# Altium project Rigid-QFN-1.PrjPcb
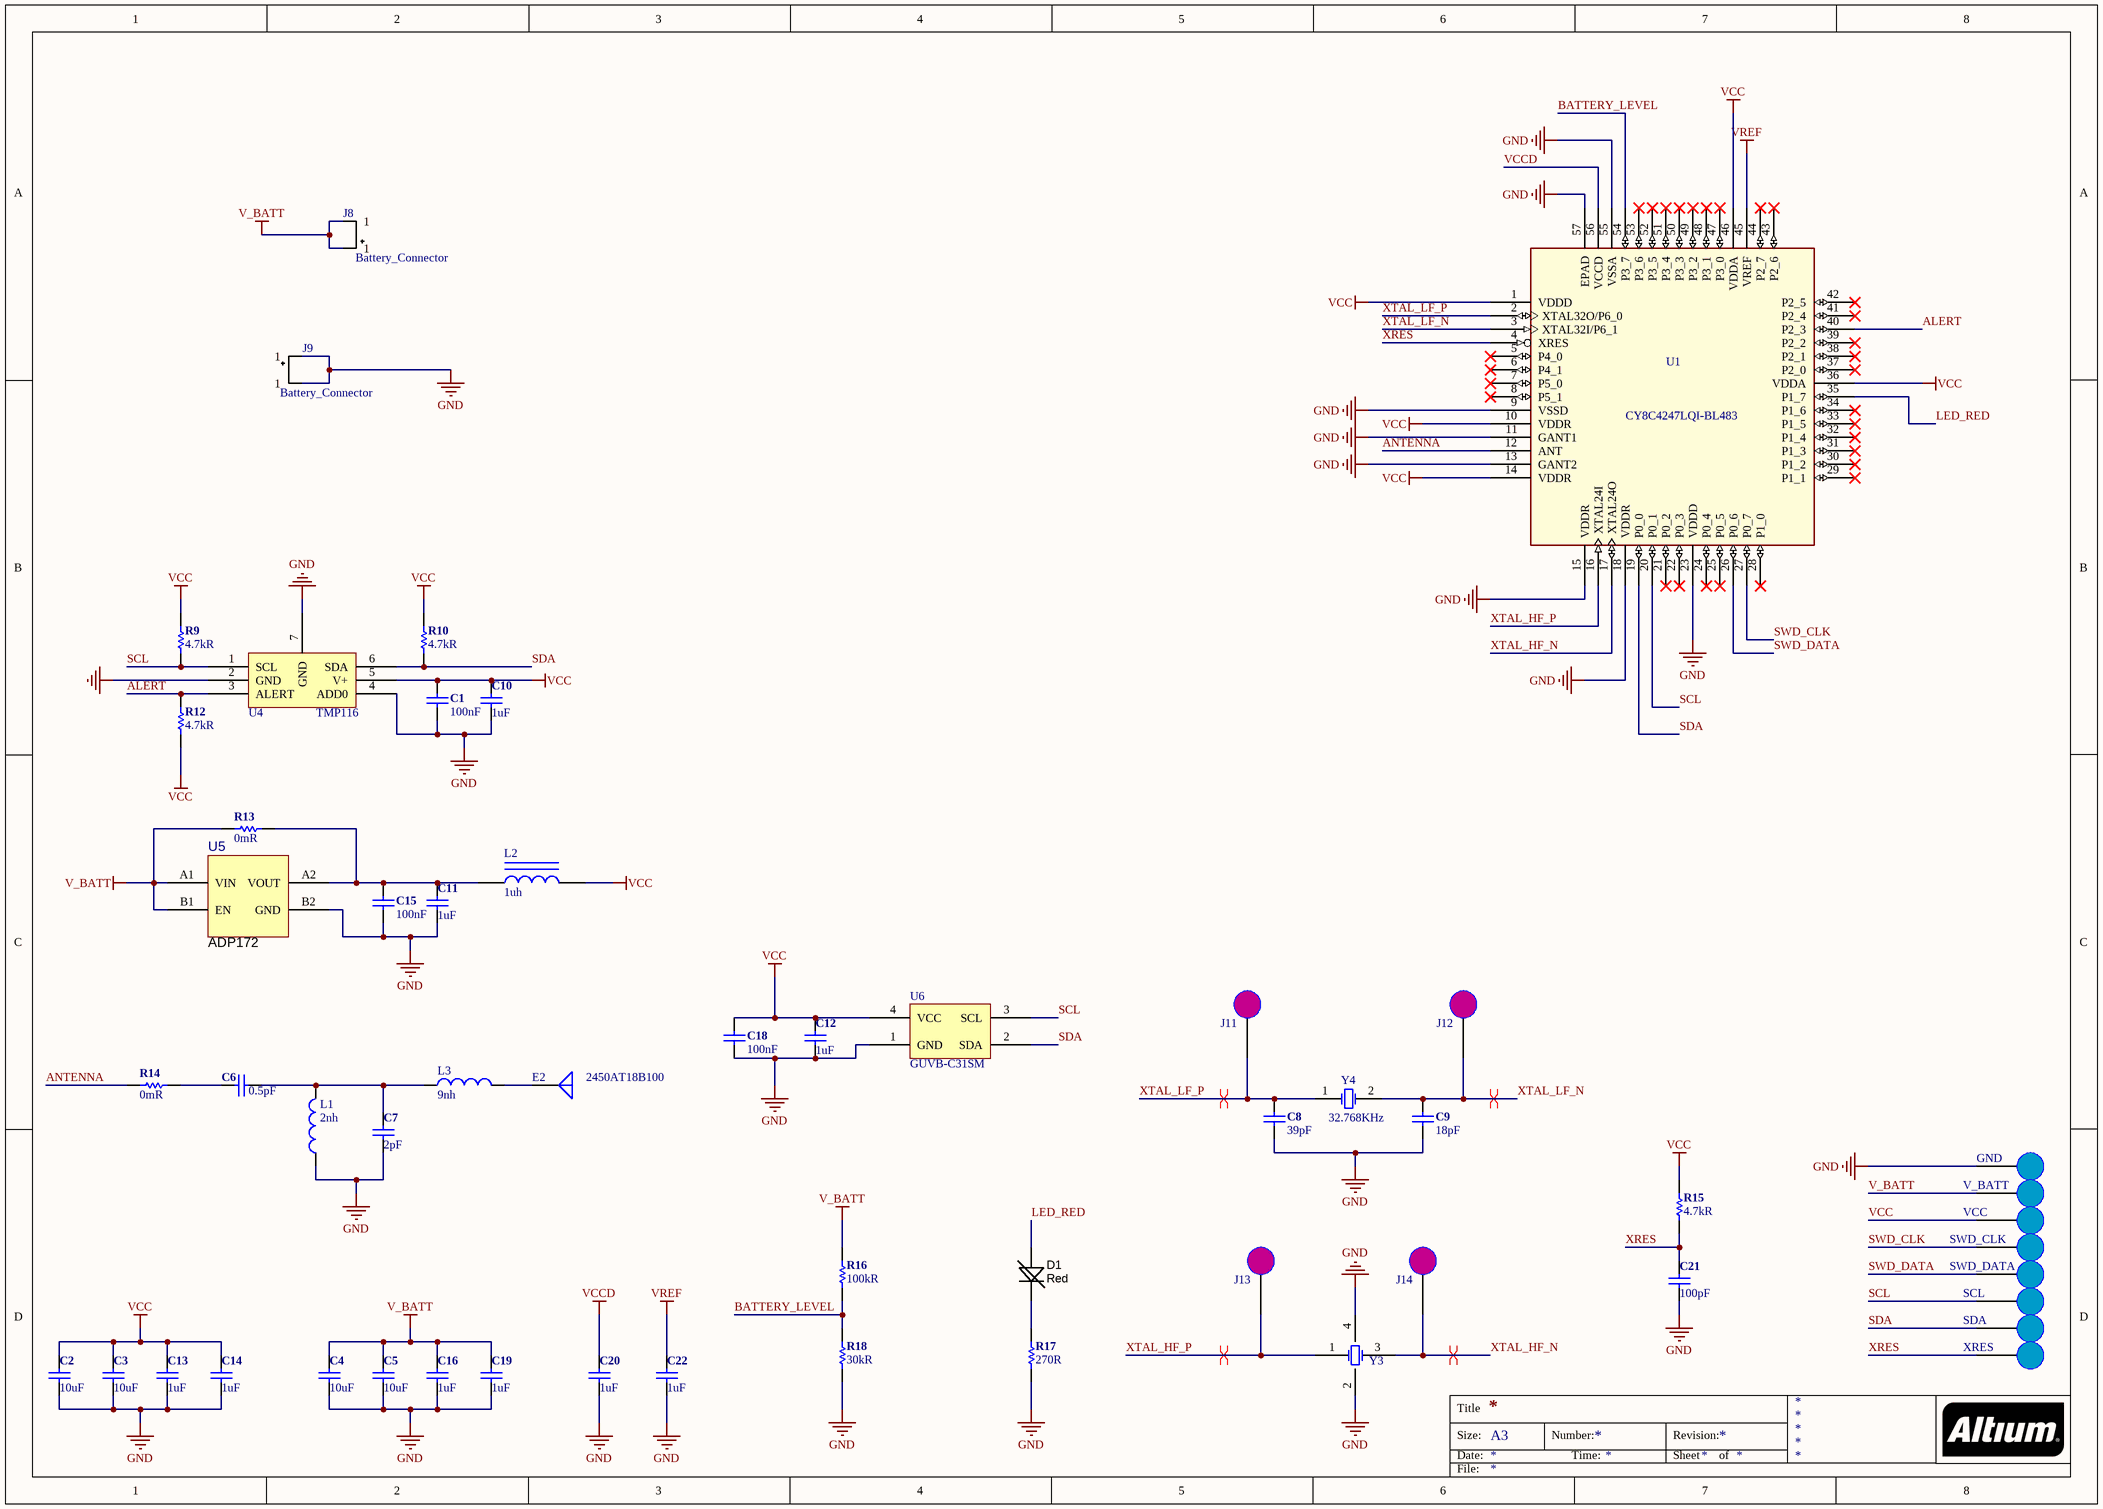
[diagram p0: Rigid-QFN-1.SchDoc]
1 sheet, 55 parts. Net scope: global (net labels, ports and power ports of the same name join across sheets).
Board file: Rigid-QFN-1.PcbDoc

## Sheet Rigid-QFN-1.SchDoc
size A3

### Parts
C1  100nF  [CAP_0402(1005)_M]
C2  10uF  [CAP_0402(1005)_M]
C3  10uF  [CAP_0402(1005)_M]
C4  10uF  [CAP_0402(1005)_M]
C5  10uF  [CAP_0402(1005)_M]
C6  0.5pF  [CAP_0402(1005)_M]
C7  2pF  [CAP_0402(1005)_M]
C8  39pF  [CAP_0402(1005)_M]
C9  18pF  [CAP_0402(1005)_M]
C10  1uF  [CAP_0402(1005)_M]
C11  1uF  [CAP_0402(1005)_M]
C12  1uF  [CAP_0402(1005)_M]
C13  1uF  [CAP_0402(1005)_M]
C14  1uF  [CAP_0402(1005)_M]
C15  100nF  [CAP_0402(1005)_M]
C16  1uF  [CAP_0402(1005)_M]
C18  100nF  [CAP_0402(1005)_M]
C19  1uF  [CAP_0402(1005)_M]
C20  1uF  [CAP_0402(1005)_M]
C21  100pF  [CAP_0402(1005)_M]
C22  1uF  [CAP_0402(1005)_M]
D1  Red  [LED_0402(1005)]
E2  2450AT18B100  [2450AT18B100]
GND  Probe-Pin Pad  [Pogo-Pin-Pad]  (value not drawn)
J8  Battery_Connector  [Battery_PAD]
J9  Battery_Connector  [Battery_PAD]
J11  Probe-CLOCK  [Pogo-CLOCK-PAD]  (value not drawn)
J12  Probe-CLOCK  [Pogo-CLOCK-PAD]  (value not drawn)
J13  Probe-CLOCK  [Pogo-CLOCK-PAD]  (value not drawn)
J14  Probe-CLOCK  [Pogo-CLOCK-PAD]  (value not drawn)
L1  2nh  [IND_0402(1005)_M]
L2  1uh  [IND_0402(1005)_M]
L3  9nh  [IND_0402(1005)_M]
R9  4.7kR  [RES_0402(1005)_M]
R10  4.7kR  [RES_0402(1005)_M]
R12  4.7kR  [RES_0402(1005)_M]
R13  0mR  [RES_0402(1005)_M]
R14  0mR  [RES_0402(1005)_M]
R15  4.7kR  [RES_0402(1005)_M]
R16  100kR  [RES_0402(1005)_M]
R17  270R  [RES_0402(1005)_M]
R18  30kR  [RES_0402(1005)_M]
SCL  Probe-Pin Pad  [Pogo-Pin-Pad]  (value not drawn)
SDA  Probe-Pin Pad  [Pogo-Pin-Pad]  (value not drawn)
SWD_CLK  Probe-Pin Pad  [Pogo-Pin-Pad]  (value not drawn)
SWD_DATA  Probe-Pin Pad  [Pogo-Pin-Pad]  (value not drawn)
U1  CY8C4247LQI-BL483  [QFN40P700X700X60-57N]
U4  TMP116  [WSON-6]
U5  ADP172  [ADP172]
U6  GUVB-C31SM  [GUVB-C31SM]
V_BATT  Probe-Pin Pad  [Pogo-Pin-Pad]  (value not drawn)
VCC  Probe-Pin Pad  [Pogo-Pin-Pad]  (value not drawn)
XRES  Probe-Pin Pad  [Pogo-Pin-Pad]  (value not drawn)
Y3  ECX-2236  [ECX-2236]  (value not drawn)
Y4  32.768KHz  [ABS05]

### Nets
GND: C1.2 C2.2 C3.2 C4.2 C5.2 C7.2 C8.2 C9.2 C10.2 C11.2 C12.2 C13.2 C14.2 C15.2 C16.2 C18.2 C19.2 C20.2 C21.2 C22.2 GND.1 J9.1 L1.1 R17.2 R18.2 U1.9(VSSD) U1.11(GANT1) U1.13(GANT2) U1.15(VDDR) U1.18(VDDR) U1.23(VDDD) U1.55(VSSA) U1.57(EPAD) U4.2(GND) U4.4(ADD0) U4.7(GND) U5.B2(GND) U6.1(GND) Y3.2(GND) Y3.4(GND)
V_BATT: C4.1 C5.1 C16.1 C19.1 J8.1 R13.1 R16.1 U5.A1(VIN) U5.B1(EN) V_BATT.1
VCC: C1.1 C2.1 C3.1 C10.1 C12.1 C13.1 C14.1 C18.1 L2.2 R9.2 R10.2 R12.1 R15.1 U1.1(VDDD) U1.10(VDDR) U1.14(VDDR) U1.36(VDDA) U1.46(VDDA) U4.5(V+) U6.4(VCC) VCC.1
VCCD: C20.1 U1.56(VCCD)
VREF: C22.1 U1.45(VREF)
ALERT: R12.2 U1.40(P2_3) U4.3(ALERT)
ANTENNA: R14.1 U1.12(ANT)
BATTERY_LEVEL: R16.2 R18.1 U1.54(P3_7)
LED_RED: D1.A U1.35(P1_7)
SCL: R9.1 SCL.1 U1.20(P0_1) U4.1(SCL) U6.3(SCL)
SDA: R10.1 SDA.1 U1.19(P0_0) U4.6(SDA) U6.2(SDA)
SWD_CLK: SWD_CLK.1 U1.27(P0_7)
SWD_DATA: SWD_DATA.1 U1.26(P0_6)
XRES: C21.1 R15.2 U1.4(XRES) XRES.1
XTAL_HF_N: J14.1 U1.17(XTAL24O) Y3.3(OSC2)
XTAL_HF_P: J13.1 U1.16(XTAL24I) Y3.1(OSC1)
XTAL_LF_N: C9.1 J12.1 U1.3(XTAL32I/P6_1) Y4.2(OSC2)
XTAL_LF_P: C8.1 J11.1 U1.2(XTAL32O/P6_0) Y4.1(OSC1)
NetC6_1: C6.1 R14.2
NetC6_2: C6.2 C7.1 L1.2 L3.1
NetC11_1: C11.1 C15.1 L2.1 R13.2 U5.A2(VOUT)
NetD1_K: D1.K R17.1
NetE2_1: E2.1(A) L3.2

Not connected (* = marked no-connect by the designer): U1 5(P4_0)* 6(P4_1)* 7(P5_0)* 8(P5_1)* 21(P0_2)* 22(P0_3)* 24(P0_4)* 25(P0_5)* 28(P1_0)* 29(P1_1)* 30(P1_2)* 31(P1_3)* 32(P1_4)* 33(P1_5)* 34(P1_6)* 37(P2_0)* 38(P2_1)* 39(P2_2)* 41(P2_4)* 42(P2_5)* 43(P2_6)* 44(P2_7)* 47(P3_0)* 48(P3_1)* 49(P3_2)* 50(P3_3)* 51(P3_4)* 52(P3_5)* 53(P3_6)*

### Layout directives
differential pair: XTAL_HF_N, XTAL_HF_P, XTAL_LF_N, XTAL_LF_P

### Notes on the sheet
- Title
- Size:
- Date:
- A3
- Number:
- Time:
- Revision:
- Sheet
- of
- File:

### Library data of the parts
C1 C15 C18 = C-0402(1005): ___ OHM ___ mW 0402(1005) SMD; Manufacturer: Yageo; Manufacturer Part Number: CC0402ZRY5V6BB104; Description 1: CAP CER 0.1UF 10V Y5V 0402; Tolerance: 80%; Voltage Rating: 10V; Dielectric: Y5V; Supplier 1: Digi-Key; Supplier Part Number 1: 311-1422-1-ND; Stock 1: 3960; Pricing 1: 1=0.1, 10=0.023, 100=0.0104, 500=0.0075, 1000=0.0059, 2500=0.0053, 5000=0.0049 (USD); Mount: Surface Mount; Case/Package: 0402; Number of Pins: 2; Weight: 2.3E-05oz; Case Code (Metric): 1005; Case Code (Imperial): 0402; Min Operating Temperature: -30°C; Max Operating Temperature: 85°C; Capacitance: 100nF; Packaging: Tape and Reel; Package Quantity: 1; Voltage Rating (DC): 10V; Termination: SMD/SMT; Composition: Ceramic; Length: 1mm; Width: 0.02inch; Thickness: 0.022inch; Depth: 0.5mm; Lead Free: Lead Free; Halogen Free: Halogen Free; ComponentLink1URL: https://datasheet.ciiva.com/176/mlccorderingcode-176345.pdf; ComponentLink1Description: https://datasheet.ciiva.com/176/mlccorderingcode-176345.pdf; ComponentLink2URL: https://datasheet.ciiva.com/176/mlccorderingcode-176346.pdf; ComponentLink2Description: https://datasheet.ciiva.com/176/mlccorderingcode-176346.pdf; ComponentLink3URL: https://datasheet.ciiva.com/176/mlccorderingcode-176347.pdf; ComponentLink3Description: https://datasheet.ciiva.com/176/mlccorderingcode-176347.pdf; ComponentLink4URL: https://datasheet.ciiva.com/13265/upy-gp-np0-16v-to-50v-8-3714-13265323.pdf; ComponentLink4Description: https://datasheet.ciiva.com/13265/upy-gp-np0-16v-to-50v-8-3714-13265323.pdf
C2-C5 = C-0402(1005): ___ OHM ___ mW 0402(1005) SMD; Manufacturer: Murata; Manufacturer Part Number: GRM155R60J106ME15D; Description 1: 10µF 6.3V Ceramic Capacitor X5R 0402 (1005 Metric) 0.039" L x 0.020" W (1.00mm x 0.50mm); Voltage Rating: 6.3V; Tolerance: 20%; Dielectric: X5R; Supplier 1: Digi-Key; Supplier Part Number 1: 490-13238-1-ND; Stock 1: 427251; Pricing 1: 1=0.29, 10=0.196, 100=0.0994, 500=0.068, 1000=0.0602, 2500=0.0576, 5000=0.0523 (USD); Mount: Surface Mount; Case/Package: 0402; Case Code (Metric): 1005; Case Code (Imperial): 0402; Min Operating Temperature: -55°C; Max Operating Temperature: 85°C; Packaging: Tape and Reel; Capacitance: 10uF; Voltage Rating (DC): 6.3V; Length: 0.039inch; Width: 0.02inch; Thickness: 0.026inch; ComponentLink1URL: http://search.murata.co.jp/Ceramy/image/img/A01X/partnumbering_e_01.pdf; ComponentLink1Description: http://search.murata.co.jp/Ceramy/image/img/A01X/partnumbering_e_01.pdf
C6 = C-0402(1005): ___ OHM ___ mW 0402(1005) SMD; Manufacturer: Murata; Manufacturer Part Number: GJM1555C1HR50WB01D; Description 1: Multilayer Ceramic Capacitors MLCC - SMD/SMT 0402 0.5pF 50Volts C0G +/-0.05pF; Voltage Rating: 50V; Dielectric: C0G; Supplier 1: Digi-Key; Supplier Part Number 1: 490-11250-1-ND; Stock 1: 57275; Pricing 1: 1=0.3, 10=0.205, 100=0.1161, 500=0.082, 1000=0.0717, 2500=0.0683, 5000=0.0632 (USD); Mount: Surface Mount; Case/Package: 0402; Case Code (Metric): 1005; Case Code (Imperial): 0402; Min Operating Temperature: -55°C; Max Operating Temperature: 125°C; Package Quantity: 10000; Capacitance: 0.5pF; Packaging: Tape and Reel; Voltage Rating (DC): 50V; Termination: SMD/SMT; Voltage: 50V; Length: 1mm; Height: 0.5mm; Width: 0.02inch; Thickness: 0.022inch; Depth: 0.5mm; Radiation Hardening: No; Lead Free: Lead Free; ComponentLink1URL: https://datasheet.ciiva.com/169/product-169683.pdf; ComponentLink1Description: https://datasheet.ciiva.com/169/product-169683.pdf
C7 = C-0402(1005): ___ OHM ___ mW 0402(1005) SMD; Manufacturer: Murata; Manufacturer Part Number: GJM1555C1H2R0BB01D; Description 1: Multilayer Ceramic Capacitors MLCC - SMD/SMT 0402 2.0pF 50Volts C0G +/-0.1pF; Voltage Rating: 50V; Dielectric: C0G; Supplier 1: Digi-Key; Supplier Part Number 1: 490-8091-1-ND; Stock 1: 103779; Pricing 1: 1=0.19, 10=0.13, 100=0.0659, 500=0.0451, 1000=0.0399, 2500=0.0381, 5000=0.0347 (USD); Mount: Surface Mount; Case/Package: 0402; Number of Pins: 2; Case Code (Metric): 1005; Case Code (Imperial): 0402; Min Operating Temperature: -55°C; Max Operating Temperature: 125°C; Package Quantity: 1; Packaging: Tape and Reel; Capacitance: 2pF; Voltage Rating (DC): 50V; Termination: SMD/SMT; Length: 1mm; Height: 0.5mm; Width: 0.5mm; Thickness: 0.022inch; Lead Pitch: 0.3mm; Depth: 0.5mm; Radiation Hardening: No; REACH SVHC: No SVHC; Lead Free: Lead Free; ComponentLink1URL: https://datasheet.ciiva.com/5694/1700193-5694978.pdf; ComponentLink1Description: https://datasheet.ciiva.com/5694/1700193-5694978.pdf; ComponentLink2URL: https://datasheet.ciiva.com/16440/l0005e-16440476.pdf; ComponentLink2Description: https://datasheet.ciiva.com/16440/l0005e-16440476.pdf; ComponentLink3URL: https://datasheet.ciiva.com/17453/product-17453487.pdf; ComponentLink3Description: https://datasheet.ciiva.com/17453/product-17453487.pdf
C8 = C-0402(1005): ___ OHM ___ mW 0402(1005) SMD; Manufacturer: KEMET; Manufacturer Part Number: CBR04C390F5GAC; Description 1: Multilayer Ceramic Capacitors MLCC - SMD/SMT 39pF 50volts 1%; Dielectric: C0G; Voltage Rating (DC): 50V; Tolerance: 1%; Supplier 1: Digi-Key; Supplier Part Number 1: 399-16083-1-ND; Stock 1: 6320; Pricing 1: 1=0.54, 10=0.374, 100=0.2247, 500=0.1685, 1000=0.1423, 2500=0.1348, 5000=0.1273 (USD); Case/Package: 0402; Weight: 2.3E-05oz; Case Code (Imperial): 0402; Case Code (Metric): 1005; Min Operating Temperature: -55°C; Max Operating Temperature: 125°C; Capacitance: 39pF; Packaging: Tape and Reel; Termination: SMD/SMT; Package Quantity: 10000; Length: 1mm; Height: 0.5mm; Width: 0.5mm; ComponentLink1URL: http://www.mouser.com/ds/2/212/KEM_C1030_CBR_SMD-346920.pdf; ComponentLink1Description: http://www.mouser.com/ds/2/212/KEM_C1030_CBR_SMD-346920.pdf
C9 = C-0402(1005): ___ OHM ___ mW 0402(1005) SMD; Manufacturer: Murata; Manufacturer Part Number: GJM1555C1H180FB01D; Description 1: Multilayer Ceramic Capacitors MLCC - SMD/SMT 0402 18pF 50Volts C0G 1%; Tolerance: 1%; Voltage Rating: 50V; Dielectric: C0G; Supplier 1: Digi-Key; Supplier Part Number 1: 490-11192-1-ND; Stock 1: 51032; Pricing 1: 1=0.24, 10=0.162, 100=0.0822, 500=0.0563, 1000=0.0498, 2500=0.0476, 5000=0.0433 (USD); Mount: Surface Mount; Case/Package: 0402; Case Code (Imperial): 0402; Case Code (Metric): 1005; Min Operating Temperature: -55°C; Max Operating Temperature: 125°C; Capacitance: 18pF; Package Quantity: 10000; Packaging: Tape and Reel; Voltage Rating (DC): 50V; Termination: SMD/SMT; Length: 1mm; Height: 0.5mm; Width: 0.02inch; Thickness: 0.022inch; Depth: 0.5mm; Radiation Hardening: No; Lead Free: Lead Free; ComponentLink1URL: https://datasheet.ciiva.com/11607/c02e-11607834.pdf; ComponentLink1Description: https://datasheet.ciiva.com/11607/c02e-11607834.pdf
C10-C14 C16 C19 C20 C22 = C-0402(1005): ___ OHM ___ mW 0402(1005) SMD; Manufacturer: KEMET; Manufacturer Part Number: C0402C105K8PACTU; Description 1: Cap Ceramic 1uF 10V X5R 10% SMD 0402 85C T/R; Dielectric Material: Ceramic; Tolerance: 10%; Voltage Rating: 10V; Dielectric: X5R; Dissipation Factor: 5%; Supplier 1: Digi-Key; Supplier Part Number 1: 399-7765-1-ND; Stock 1: 0; Pricing 1: 1=0.13, 10=0.093, 100=0.0416, 500=0.0297, 1000=0.0233, 2500=0.0212, 5000=0.0195 (USD); Mount: Surface Mount,PCB; Case/Package: 0402; Number of Pins: 2; Case Code (Metric): 1005; Case Code (Imperial): 0402; Contact Plating: Tin,Matte; Min Operating Temperature: -55°C; Max Operating Temperature: 85°C; Capacitance: 1uF; Package Quantity: 1; Packaging: Tape and Reel; Voltage Rating (DC): 10V; Termination: SMD/SMT; Voltage: 10V; Length: 1mm; Height: 0.5mm; Width: 0.02inch; Thickness: 0.022inch; Depth: 0.5mm; Radiation Hardening: No; REACH SVHC: No SVHC; Lead Free: Lead Free; ComponentLink1URL: https://datasheet.ciiva.com/7747/40889-7747622.pdf; ComponentLink1Description: https://datasheet.ciiva.com/7747/40889-7747622.pdf; ComponentLink2URL: https://datasheet.ciiva.com/28610/1918694-28610762.pdf; ComponentLink2Description: https://datasheet.ciiva.com/28610/1918694-28610762.pdf; ComponentLink3URL: https://datasheet.ciiva.com/18219/getdatasheetpartid-158224-18219180.pdf; ComponentLink3Description: https://datasheet.ciiva.com/18219/getdatasheetpartid-158224-18219180.pdf; ComponentLink4URL: https://datasheet.ciiva.com/22693/1929483-22693871.pdf; ComponentLink4Description: https://datasheet.ciiva.com/22693/1929483-22693871.pdf; ComponentLink5URL: https://datasheet.ciiva.com/28645/1789732-28645391.pdf; ComponentLink5Description: https://datasheet.ciiva.com/28645/1789732-28645391.pdf
C21 = C-0402(1005): ___ OHM ___ mW 0402(1005) SMD; Manufacturer: Wurth Electronics; Manufacturer Part Number: 885012005013; Description 1: 100pF 10V Ceramic Capacitor C0G, NP0 0402 (1005 Metric) 0.039" L x 0.020" W (1.00mm x 0.50mm); Voltage Rating: 10V; Tolerance: 5%; Supplier 1: Digi-Key; Supplier Part Number 1: 732-7431-1-ND; Stock 1: 12906; Pricing 1: 1=0.1, 10=0.017, 100=0.0152, 500=0.0134 (USD); Mount: Surface Mount; Case/Package: 0402; Case Code (Metric): 1005; Case Code (Imperial): 0402; Min Operating Temperature: -55°C; Max Operating Temperature: 125°C; Packaging: Tape and Reel; Capacitance: 100pF; Length: 0.039inch; Width: 0.02inch; Thickness: 0.022inch
D1 = LED_0402(1005): LED, 0402(1005) SMD; Manufacturer: Kingbright; Manufacturer Part Number: APHHS1005SURCK; Description 1: LED 1X0.5MM 630NM RD WTR CLR SMD; Lens Colour: Clear; Forward Current: 20mA; Forward Voltage: 1.95V; Luminous Intensity: 220mcd; Viewing Angle: 120°; Wavelength: 635nm; Lens Style: Flat,Clear; Dominant Wavelength: 630nm; Number of LEDs: 1; Supplier 1: Digi-Key; Supplier Part Number 1: 754-1104-1-ND; Stock 1: 195639; Pricing 1: 1=0.44, 10=0.318, 25=0.2596, 100=0.2077, 250=0.1752, 500=0.1493, 1000=0.1168 (USD); Mount: Surface Mount; Case/Package: 0402; Number of Pins: 2; Colour: Red; Case Code (Metric): 1005; Case Code (Imperial): 0402; Min Operating Temperature: -40°C; Max Operating Temperature: 85°C; Packaging: Tape and Reel; Package Quantity: 2000; Illumination Colour: Red; Test Current: 20mA; Length: 1mm; Height: 0.6mm; Width: 0.5mm; Lead Free: Lead Free; ComponentLink1URL: https://datasheet.ciiva.com/14603/70062833-14603899.pdf; ComponentLink1Description: https://datasheet.ciiva.com/14603/70062833-14603899.pdf; ComponentLink2URL: https://datasheet.ciiva.com/2114/aphhs1005surck-2114140.pdf; ComponentLink2Description: https://datasheet.ciiva.com/2114/aphhs1005surck-2114140.pdf; ComponentLink3URL: https://datasheet.ciiva.com/4689/aphhs1005surck-32322-4689068.pdf; ComponentLink3Description: https://datasheet.ciiva.com/4689/aphhs1005surck-32322-4689068.pdf; ComponentLink4URL: https://datasheet.ciiva.com/2114/aphhs1005surck-2114141.pdf; ComponentLink4Description: https://datasheet.ciiva.com/2114/aphhs1005surck-2114141.pdf; ComponentLink5URL: https://datasheet.ciiva.com/2114/aphhs1005surck-2114142.pdf; ComponentLink5Description: https://datasheet.ciiva.com/2114/aphhs1005surck-2114142.pdf
E2 = 2450AT18B100: 2.4 GHz BLE Antenna; Manufacturer: Johanson; Manufacturer Part Number: 2450AT18B100E; Description 1: JOHANSON TECHNOLOGY         2450AT18B100E             ANTENNA, CERAMIC, 2.45GHZ; Impedance: 50R; Bandwidth: 100MHz; Power Rating: 3W; Frequency: 2.45GHz; Number of Bands: 1; Return Loss: -9.5dB; Max Frequency: 2.5GHz; Gain: -0.5dB; Supplier 1: Digi-Key; Supplier Part Number 1: 712-1006-1-ND; Stock 1: 187598; Pricing 1: 1=0.62, 10=0.541, 25=0.4788, 100=0.4172, 250=0.3631, 500=0.309, 1000=0.2472 (USD); Mount: Surface Mount; Case/Package: CSMD; Contact Plating: Tin; Packaging: Tape and Reel; Package Quantity: 1; Max Power Dissipation: 3W; Termination: Solder; Length: 3.2mm; Height: 0.051inch; Width: 1.6mm; REACH SVHC: No SVHC; ComponentLink1URL: https://datasheet.ciiva.com/1124/1318299-1124918.pdf; ComponentLink1Description: https://datasheet.ciiva.com/1124/1318299-1124918.pdf; ComponentLink2URL: https://datasheet.ciiva.com/24025/antenna-2450at18b100-242422-24025839.pdf; ComponentLink2Description: https://datasheet.ciiva.com/24025/antenna-2450at18b100-242422-24025839.pdf
L1 = I-0402(1005): Manufacturer: Abracon; Manufacturer Part Number: AISC-0402-2N0J-T; Description 1: 2nH Unshielded Wirewound Inductor 1.04A 70 mOhm Max 0402 (1005 Metric); Core Material: Ceramic; Current Rating: 1.04A; Tolerance: 5%; Shielding: Unshielded; Q Factor: 16; Self Resonant Frequency: 11.1GHz; DC Resistance (DCR): 70mR; Test Frequency: 250MHz; Supplier 1: Digi-Key; Supplier Part Number 1: 535-10424-6-ND; Stock 1: 5165; Pricing 1: 1=0.33, 10=0.297, 25=0.264, 50=0.231, 100=0.2145, 500=0.1881, 750=0.1716, 1000=0.1518 (USD); Mount: Surface Mount; Case/Package: 0402; Number of Pins: 2; Case Code (Metric): 1005; Case Code (Imperial): 0402; Min Operating Temperature: -40°C; Max Operating Temperature: 125°C; Package Quantity: 10000; Packaging: Tape and Reel; Composition: Wirewound,Ceramic; Inductance: 2nh; Max DC Current: 1.04A; Termination: SMD/SMT; DC Current: 1.04A; Military Standard: Not; Length: 1.19mm; Height: 0.66mm; Width: 0.025inch; Height - Seated (Max): 0.026inch; Depth: 0.64mm; Radiation Hardening: No; ComponentLink1URL: https://datasheet.ciiva.com/1054/aisc-0402-1054032.pdf; ComponentLink1Description: https://datasheet.ciiva.com/1054/aisc-0402-1054032.pdf; ComponentLink2URL: https://datasheet.ciiva.com/26928/getdatasheetpartid-762366-26928064.pdf; ComponentLink2Description: https://datasheet.ciiva.com/26928/getdatasheetpartid-762366-26928064.pdf; ComponentLink3URL: https://datasheet.ciiva.com/11140/aisc-0402-11140262.pdf; ComponentLink3Description: https://datasheet.ciiva.com/11140/aisc-0402-11140262.pdf; ComponentLink4URL: https://datasheet.ciiva.com/1054/aisc-0402-1054030.pdf; ComponentLink4Description: https://datasheet.ciiva.com/1054/aisc-0402-1054030.pdf; ComponentLink5URL: https://datasheet.ciiva.com/1054/aisc-0402-1054031.pdf; ComponentLink5Description: https://datasheet.ciiva.com/1054/aisc-0402-1054031.pdf
L2 = Inductor Iron: Magnetic-Core Inductor; Manufacturer: TDK; Manufacturer Part Number: MLZ1005M1R0WT000; Description 1: FIXED IND 1UH 450MA 350 MOHM SMD; Core Material: Ferrite; Tolerance: 20%; Current Rating: 450mA; Saturation Current: 100mA; Shielding: Shielded; DC Resistance (DCR): 455mR; Self Resonant Frequency: 170MHz; Test Frequency: 2MHz; Supplier 1: Digi-Key; Supplier Part Number 1: 445-6379-1-ND; Stock 1: 22743; Pricing 1: 1=0.29, 10=0.258, 100=0.1771, 500=0.1513, 1000=0.1159, 2500=0.1095 (USD); Mount: Surface Mount; Case/Package: 0402; Case Code (Metric): 1005; Case Code (Imperial): 0402; Min Operating Temperature: -55°C; Max Operating Temperature: 125°C; Package Quantity: 10000; Packaging: Tape and Reel; Inductance: 1uh; Length: 0.039inch; Width: 0.02inch; Height - Seated (Max): 0.022inch; ComponentLink1URL: https://datasheet.ciiva.com/29699/inductor-commercial-decoupling-mlz-en-29699052.pdf; ComponentLink1Description: https://datasheet.ciiva.com/29699/inductor-commercial-decoupling-mlz-en-29699052.pdf; ComponentLink2URL: https://datasheet.ciiva.com/29699/inductor-commercial-decoupling-mlz-en-29699053.pdf; ComponentLink2Description: https://datasheet.ciiva.com/29699/inductor-commercial-decoupling-mlz-en-29699053.pdf
L3 = I-0402(1005): Manufacturer: Murata; Manufacturer Part Number: LQW15AN9N0G80D; Description 1: 9nH Unshielded Wirewound Inductor 1.42A 70 mOhm Max 0402 (1005 Metric); Current Rating: 1.42A; Shielding: Unshielded; DC Resistance (DCR): 70mR; Self Resonant Frequency: 6.5GHz; Test Frequency: 100MHz; Tolerance: 2%; Supplier 1: Digi-Key; Supplier Part Number 1: 490-14715-1-ND; Stock 1: 3213; Pricing 1: 1=0.25, 10=0.221, 100=0.1518, 500=0.1297, 1000=0.0994, 2500=0.0938 (USD); Mount: Surface Mount; Case/Package: 0402; Min Operating Temperature: -55°C; Max Operating Temperature: 125°C; Packaging: Tape and Reel; Composition: Wirewound; Inductance: 9nh; Length: 0.039inch; Width: 0.024inch; Height - Seated (Max): 0.024inch
R9 R10 R12 R15 = R-0402(1005): ___ OHM ___ mW 0402(1005) SMD; Manufacturer: Yageo; Manufacturer Part Number: RC0402JR-074K7P; Description 1: RES SMD 4.7K OHM 5% 1/16W 0402; Tolerance: 5%; Max Power Dissipation: 63mW; Temperature Coefficient: 150ppm/°C; Supplier 1: Digi-Key; Supplier Part Number 1: YAG1287CT-ND; Stock 1: 48445; Pricing 1: 1=0.1, 10=0.019, 100=0.0075, 1000=0.0034, 2500=0.0029, 5000=0.0024 (USD); Case/Package: 0402; Case Code (Metric): 1005; Case Code (Imperial): 0402; Min Operating Temperature: -55°C; Max Operating Temperature: 155°C; Packaging: Tape and Reel; Resistance: 4.7kR; Composition: Thick Film; Number of Terminations: 2; Length: 0.039inch; Height: 0.016inch; Width: 0.02inch; ComponentLink1URL: http://www.yageo.com.tw/exep/pages/download/literatures/PYu-R_INT-thick_7.pdf; ComponentLink1Description: http://www.yageo.com.tw/exep/pages/download/literatures/PYu-R_INT-thick_7.pdf
R13 R14 = R-0402(1005): ___ OHM ___ mW 0402(1005) SMD; Manufacturer: Yageo; Manufacturer Part Number: AC0402JR-070RL; Description 1: RES SMD 0.0OHM JUMPER 1/16W 0402; Voltage Rating: 50V; Power Rating: 62.5mW; Tolerance: 5%; Temperature Coefficient: 200ppm/°C; Max Power Dissipation: 63mW; Supplier 1: Digi-Key; Supplier Part Number 1: 311-0.0LBCT-ND; Stock 1: 4; Pricing 1: 1=0.1, 10=0.019, 25=0.014, 50=0.0108, 100=0.0079, 250=0.006, 500=0.0048, 1000=0.0036, 5000=0.0026 (USD); Case/Package: 0402; Case Code (Imperial): 0402; Case Code (Metric): 1005; Min Operating Temperature: -55°C; Max Operating Temperature: 155°C; Resistance: 0mR; Packaging: Tape and Reel; Package Quantity: 1; Composition: Thick Film; Termination: SMD/SMT; Number of Terminations: 2; Length: 0.039inch; Height: 0.015inch; Width: 0.02inch; Lead Free: Lead Free; ComponentLink1URL: http://www.mouser.com/ds/2/447/yageodocoutput-1111992.pdf; ComponentLink1Description: http://www.mouser.com/ds/2/447/yageodocoutput-1111992.pdf; ComponentLink2URL: http://www.yageo.com/NewPortal/yageodocoutput?fileName=/pdf/R-Chip/PYu-AC_51_RoHS_L_6.pdf; ComponentLink2Description: http://www.yageo.com/NewPortal/yageodocoutput?fileName=/pdf/R-Chip/PYu-AC_51_RoHS_L_6.pdf; ComponentLink3URL: http://www.yageo.com/documents/recent/PYu-AC_51_RoHS_L_2_revised.pdf; ComponentLink3Description: http://www.yageo.com/documents/recent/PYu-AC_51_RoHS_L_2_revised.pdf
R16 = R-0402(1005): ___ OHM ___ mW 0402(1005) SMD; Manufacturer: Yageo; Manufacturer Part Number: AC0402JR-07100KL; Description 1: Thick Film Resistors - SMD 1/16W 100K ohm 5%; Power Rating: 62.5mW; Tolerance: 5%; Voltage Rating: 50V; Temperature Coefficient: 100ppm/°C; Max Power Dissipation: 63mW; Supplier 1: Digi-Key; Supplier Part Number 1: YAG3515CT-ND; Stock 1: 136750; Pricing 1: 1=0.1, 10=0.02, 100=0.0082, 1000=0.0037, 2500=0.0032, 5000=0.0026 (USD); Case/Package: 0402; Case Code (Imperial): 0402; Case Code (Metric): 1005; Min Operating Temperature: -55°C; Max Operating Temperature: 155°C; Packaging: Tape and Reel; Resistance: 100kR; Composition: Thick Film; Termination: SMD/SMT; Number of Terminations: 2; Military Standard: Not; Length: 1mm; Height: 0.015inch; Width: 0.5mm; Depth: 0.5mm; Lead Free: Lead Free; ComponentLink1URL: https://datasheet.ciiva.com/26862/getdatasheetpartid-553131-26862451.pdf; ComponentLink1Description: https://datasheet.ciiva.com/26862/getdatasheetpartid-553131-26862451.pdf
R17 = R-0402(1005): ___ OHM ___ mW 0402(1005) SMD; Manufacturer: Yageo; Manufacturer Part Number: RC0402JR-07270RL; Description 1: RES SMD 270 OHM 5% 1/16W 0402; Tolerance: 5%; Power Rating: 62.5mW; Voltage Rating: 50V; Max Power Dissipation: 63mW; Temperature Coefficient: 100ppm/°C; Supplier 1: Digi-Key; Supplier Part Number 1: 311-270JRCT-ND; Stock 1: 176696; Pricing 1: 1=0.1, 10=0.012, 100=0.005, 1000=0.0022, 2500=0.0019, 5000=0.0016 (USD); Case/Package: 0402; Case Code (Metric): 1005; Case Code (Imperial): 0402; Min Operating Temperature: -55°C; Max Operating Temperature: 155°C; Packaging: Tape and Reel; Resistance: 270R; Package Quantity: 1; Composition: Thick Film; Number of Terminations: 2; Termination: SMD/SMT; Military Standard: Not; Working Voltage: 50V; Length: 1mm; Height: 0.016inch; Width: 0.02inch; Depth: 0.5mm; REACH SVHC: Unknown; Lead Free: Lead Free; ComponentLink1URL: https://datasheet.ciiva.com/7850/1018594-7850184.pdf; ComponentLink1Description: https://datasheet.ciiva.com/7850/1018594-7850184.pdf; ComponentLink2URL: https://datasheet.ciiva.com/2518/pyu-r-int-thick-7-2518937.pdf; ComponentLink2Description: https://datasheet.ciiva.com/2518/pyu-r-int-thick-7-2518937.pdf; ComponentLink3URL: https://datasheet.ciiva.com/7850/1018594-7850185.pdf; ComponentLink3Description: https://datasheet.ciiva.com/7850/1018594-7850185.pdf; ComponentLink4URL: https://datasheet.ciiva.com/2518/pyu-r-int-thick-7-2518938.pdf; ComponentLink4Description: https://datasheet.ciiva.com/2518/pyu-r-int-thick-7-2518938.pdf; ComponentLink5URL: https://datasheet.ciiva.com/12558/pyu-rc0402-51-rohs-l-6-r-8721-12558282.pdf; ComponentLink5Description: https://datasheet.ciiva.com/12558/pyu-rc0402-51-rohs-l-6-r-8721-12558282.pdf; ComponentLink6URL: https://datasheet.ciiva.com/16740/pyu-rc0402-51-rohs-l-6-r-16740906.pdf; ComponentLink6Description: https://datasheet.ciiva.com/16740/pyu-rc0402-51-rohs-l-6-r-16740906.pdf; ComponentLink7URL: https://datasheet.ciiva.com/2518/pyu-r-int-thick-7-2518939.pdf; ComponentLink7Description: https://datasheet.ciiva.com/2518/pyu-r-int-thick-7-2518939.pdf
R18 = R-0402(1005): ___ OHM ___ mW 0402(1005) SMD; Manufacturer: Yageo; Manufacturer Part Number: RC0402JR-0730KL; Description 1: RES SMD 30K OHM 5% 1/16W 0402; Tolerance: 5%; Power Rating: 62.5mW; Voltage Rating: 50V; Temperature Coefficient: 100ppm/°C; Max Power Dissipation: 63mW; Supplier 1: Digi-Key; Supplier Part Number 1: 311-30KJRCT-ND; Stock 1: 666192; Pricing 1: 1=0.1, 10=0.012, 100=0.005, 1000=0.0022, 2500=0.0019, 5000=0.0016 (USD); Case/Package: 0402; Number of Pins: 2; Weight: 2.3E-05oz; Case Code (Metric): 1005; Case Code (Imperial): 0402; Contact Plating: Tin,Matte; Min Operating Temperature: -55°C; Max Operating Temperature: 155°C; Resistance: 30kR; Packaging: Tape and Reel; Composition: Thick Film; Termination: SMD/SMT; Military Standard: Not; Voltage Rating (DC): 50V; Package Quantity: 10000; Number of Terminations: 2; Working Voltage: 50V; Length: 1mm; Height: 0.016inch; Width: 0.02inch; Depth: 0.5mm; Radiation Hardening: No; Lead Free: Lead Free; ComponentLink1URL: https://datasheet.ciiva.com/2491/pyu-r-int-thick-7-2491204.pdf; ComponentLink1Description: https://datasheet.ciiva.com/2491/pyu-r-int-thick-7-2491204.pdf; ComponentLink2URL: https://datasheet.ciiva.com/7983/1018594-7983575.pdf; ComponentLink2Description: https://datasheet.ciiva.com/7983/1018594-7983575.pdf; ComponentLink3URL: https://datasheet.ciiva.com/16863/pyu-rc0402-51-rohs-l-6-16863162.pdf; ComponentLink3Description: https://datasheet.ciiva.com/16863/pyu-rc0402-51-rohs-l-6-16863162.pdf; ComponentLink4URL: https://datasheet.ciiva.com/28401/pyu-rc0402-51-rohs-l-6-28401244.pdf; ComponentLink4Description: https://datasheet.ciiva.com/28401/pyu-rc0402-51-rohs-l-6-28401244.pdf; ComponentLink5URL: https://datasheet.ciiva.com/12577/pyu-rc0402-51-rohs-l-6-r-12577407.pdf; ComponentLink5Description: https://datasheet.ciiva.com/12577/pyu-rc0402-51-rohs-l-6-r-12577407.pdf
U1 = CY8C4247LQI-BL483: Manufacturer: Cypress; Description 1: MCU 32-Bit PSoC 4100 ARM Cortex M0 RISC 128KB Flash 1.8V/2.5V/3.3V/5V 56-Pin QFN EP Tray; RAM Size: 16KB; Min Supply Voltage: 1.71V; Max Supply Voltage: 5.5V; Number of Timers/Counters: 4; Frequency: 48MHz; Interface: I2C,SPI,I2S,IrDA,SSP,UART,USART,LIN; Data Bus Width: 32b; Number of I/Os: 36; Watchdog Timer: Yes; Memory Type: FLASH; Memory Size: 128KB; Peripherals: Brown-out Detect/Reset,POR,PWM,WDT,LVD,LCD; Core Architecture: ARM; Oscillator Type: Internal; Supplier 1: Digi-Key; Supplier Part Number 1: 428-3368-5-ND; Manufacturer Part Number: CY8C4247LQI-BL483; Stock 1: 2788; Pricing 1: 1=6.83, 10=6.143, 25=5.5964, 100=5.0505, 250=4.641, 500=4.2315, 1000=3.6855, 2500=3.549 (USD); Mount: Surface Mount; Case/Package: QFN; Number of Pins: 56; Weight: 0.006751oz; Min Operating Temperature: -40°C; Max Operating Temperature: 85°C; Packaging: Tray; Package Quantity: 260; Max Frequency: 48MHz; REACH SVHC: No SVHC; Lead Free: Lead Free; ComponentLink1URL: https://datasheet.ciiva.com/48533/001-90479-0i-v-48533513.pdf; ComponentLink1Description: https://datasheet.ciiva.com/48533/001-90479-0i-v-48533513.pdf; Number of Programmable I/O: 36; Length: 7mm; Height: 0.6mm; Width: 7mm
U4 = TMP116: TI Digital I2C Temperature Sensor; Manufacturer: Texas Instruments; Manufacturer Part Number: TMP116AIDRVT; Interface: I2C,SMBus,2-Wire; Supplier 1: Digi-Key; Supplier Part Number 1: 296-46944-1-ND; Stock 1: 995; Pricing 1: 1=4.01, 10=3.599, 100=2.9485 (USD); Min Operating Temperature: -55°C; Max Operating Temperature: 150°C
U5 = ADP172: 3V LDO; Manufacturer: Analog Devices; Manufacturer Part Number: ADP172ACBZ-3.0-R7; Description 1: Linear Voltage Regulator IC Positive Fixed 1 Output 3V 300mA 4-WLCSP (0.95x1.03); Dropout Voltage: 50mV; Number of Outputs: 1; Min Input Voltage: 1.6V; Max Input Voltage: 3.6V; Max Output Current: 300mA; Min Current Limit: 400mA; Polarity: Positive; Nominal Supply Current: 23uA; Quiescent Current: 60uA; Power Supply Rejection Ratio (PSRR): 73dB; Max Supply Current: 170uA; Min Output Voltage: 800mV; Supplier 1: Digi-Key; Supplier Part Number 1: ADP172ACBZ-3.0-R7CT-ND; Stock 1: 438; Pricing 1: 1=1.13, 10=1.013, 100=0.7896, 500=0.6523, 1000=0.515 (USD); Mount: Surface Mount; Number of Pins: 4; Contact Plating: Copper,Tin,Silver; Min Operating Temperature: -40°C; Max Operating Temperature: 125°C; Package Quantity: 3000; Packaging: Tape and Reel; Output Voltage: 3V; Output Current: 300mA; Number of Regulators: 1; Operating Supply Current: 23uA; Max Output Voltage: 3V; Radiation Hardening: No; Lead Free: Contains Lead; ComponentLink1URL: https://datasheet.ciiva.com/2056/adp172-2056690.pdf; ComponentLink1Description: https://datasheet.ciiva.com/2056/adp172-2056690.pdf; ComponentLink2URL: https://datasheet.ciiva.com/2056/adp172-2056691.pdf; ComponentLink2Description: https://datasheet.ciiva.com/2056/adp172-2056691.pdf; ComponentLink3URL: https://datasheet.ciiva.com/2056/adp172-2056692.pdf; ComponentLink3Description: https://datasheet.ciiva.com/2056/adp172-2056692.pdf; ComponentLink4URL: https://datasheet.ciiva.com/3224/adp172-3224693.pdf; ComponentLink4Description: https://datasheet.ciiva.com/3224/adp172-3224693.pdf; ComponentLink5URL: https://datasheet.ciiva.com/17365/adp172-17365245.pdf; ComponentLink5Description: https://datasheet.ciiva.com/17365/adp172-17365245.pdf; ComponentLink6URL: https://datasheet.ciiva.com/48694/001251525-da-01-en-ic-reg-ldo-adp172acbz-3-0-r7-wlcsp-4-adi-48694412.pdf; ComponentLink6Description: https://datasheet.ciiva.com/48694/001251525-da-01-en-ic-reg-ldo-adp172acbz-3-0-r7-wlcsp-4-adi-48694412.pdf
Y3 = ECX-2236: 24 MHz Crystal; Manufacturer: ECS International; Manufacturer Part Number: ECS-240-8-36CKM-TR; Description 1: Crystals 24MHz 10ppm; ESR (Equivalent Series Resistance): 60R; Frequency: 24MHz; Load Capacitance: 8pF; Frequency Stability: 10ppm; Supplier 1: Digi-Key; Supplier Part Number 1: XC1557CT-ND; Stock 1: 30313; Pricing 1: 1=1.12, 10=0.987, 50=0.9224, 100=0.8151, 500=0.7722 (USD); Mount: Surface Mount; Case/Package: SMD/SMT; Min Operating Temperature: -20°C; Max Operating Temperature: 70°C; Package Quantity: 1000; Packaging: Tape and Reel; Frequency Tolerance: 10ppm; Tolerance: 10ppm; Termination: SMD/SMT; Length: 0.098inch; Height: 0.026inch; Width: 0.079inch; ComponentLink1URL: http://www.ecsxtal.com/store/pdf/partnumber4.pdf; ComponentLink1Description: http://www.ecsxtal.com/store/pdf/partnumber4.pdf; ComponentLink2URL: http://www.mouser.com/ds/2/122/ECX-2236-15751.pdf; ComponentLink2Description: http://www.mouser.com/ds/2/122/ECX-2236-15751.pdf
Y4 = ABS05: Crystal Oscillator; Manufacturer: Abracon; Manufacturer Part Number: ABS05-32.768KHZ-T; Description 1: 32.768kHz ±20ppm Crystal 12.5pF 90 kOhm -40°C ~ 85°C  Surface Mount 2-SMD; Frequency Tolerance: 20ppm; Load Capacitance: 12.5pF; ESR (Equivalent Series Resistance): 90kR; Supplier 1: Digi-Key; Supplier Part Number 1: 535-11899-1-ND; Stock 1: 92285; Pricing 1: 1=1.03, 10=0.911, 50=0.8514, 100=0.7524, 500=0.7128, 1000=0.594 (USD); Mount: Surface Mount; Case/Package: SMD/SMT; Number of Pins: 2; Min Operating Temperature: -40°C; Max Operating Temperature: 85°C; Packaging: Tape and Reel; Package Quantity: 3000; Frequency: 32.768kHz; Tolerance: 20ppm; Termination: SMD/SMT; Series Resistance: 90kR; Length: 1.6mm; Height: 0.02inch; Width: 0.039inch; Depth: 1mm; Radiation Hardening: No; REACH SVHC: No SVHC; Lead Free: Lead Free; ComponentLink1URL: https://datasheet.ciiva.com/23810/abs05-23810480.pdf; ComponentLink1Description: https://datasheet.ciiva.com/23810/abs05-23810480.pdf; ComponentLink2URL: https://datasheet.ciiva.com/6728/abs05-6728949.pdf; ComponentLink2Description: https://datasheet.ciiva.com/6728/abs05-6728949.pdf; ComponentLink3URL: https://datasheet.ciiva.com/6728/abs05-6728950.pdf; ComponentLink3Description: https://datasheet.ciiva.com/6728/abs05-6728950.pdf; ComponentLink4URL: https://datasheet.ciiva.com/16411/abs05-16411149.pdf; ComponentLink4Description: https://datasheet.ciiva.com/16411/abs05-16411149.pdf